# EAGLE schematic pmm (EAGLE 9.6.2)
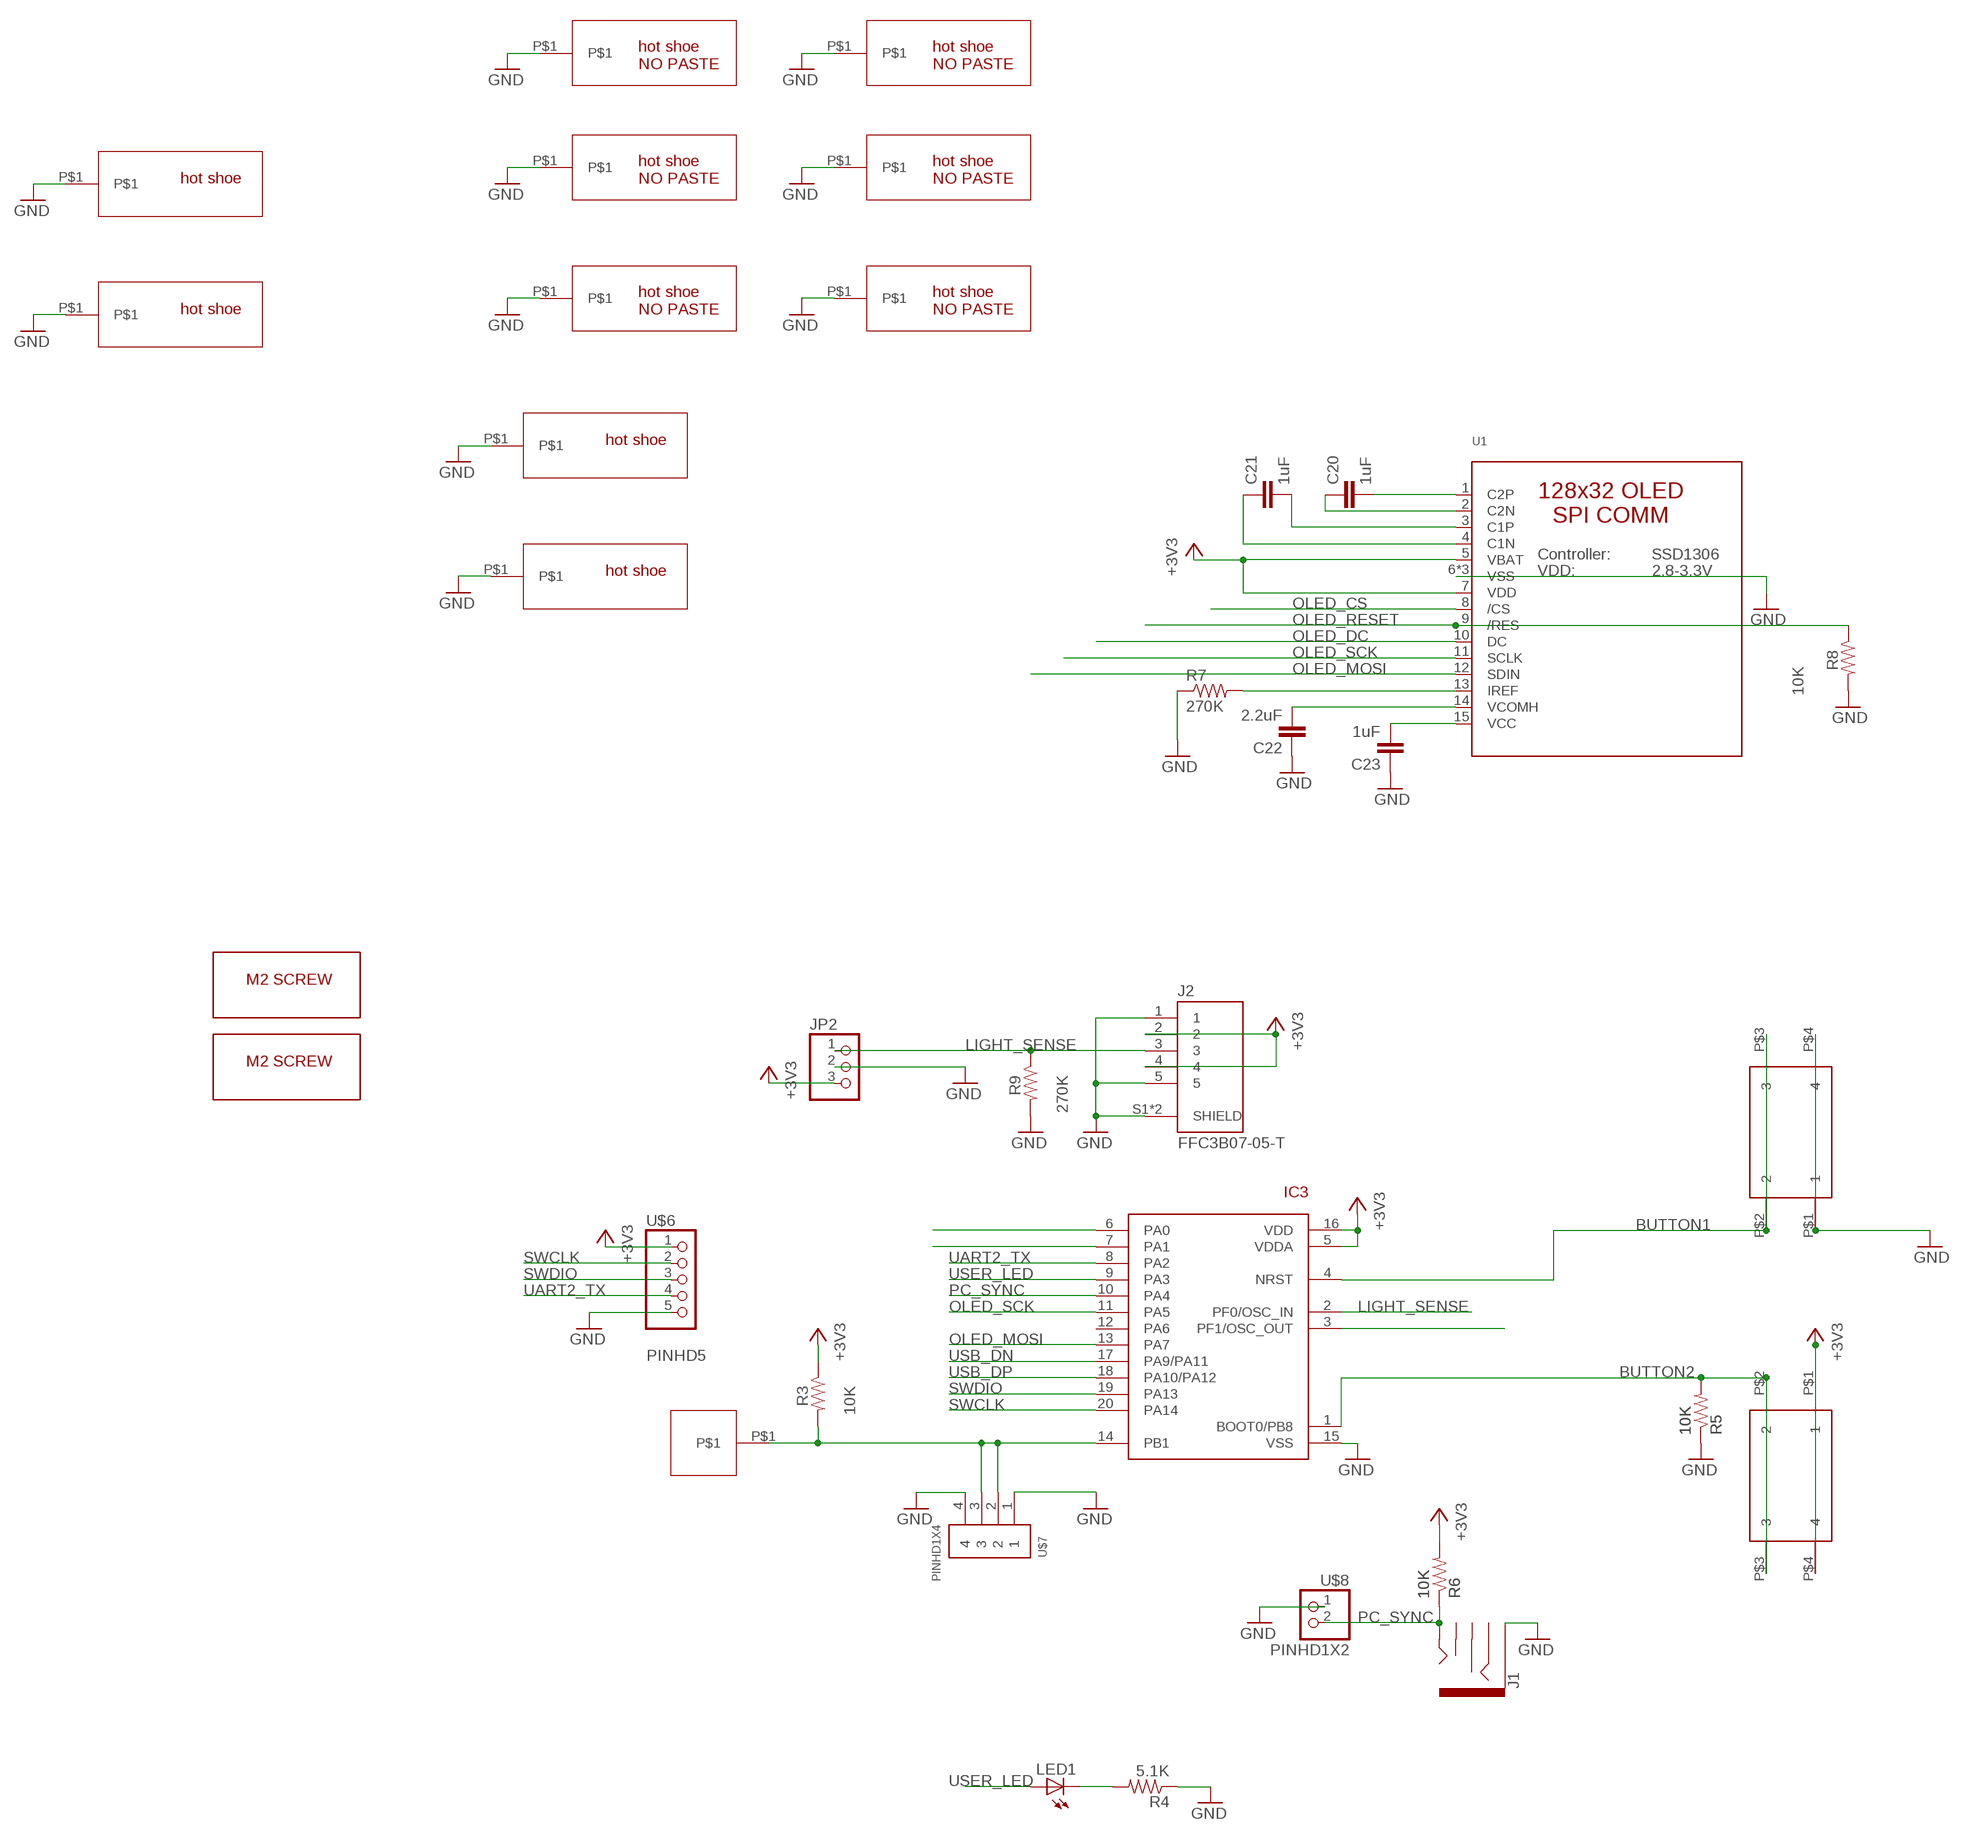
[diagram p0: schematic, sheet 1, part 1 of 2]
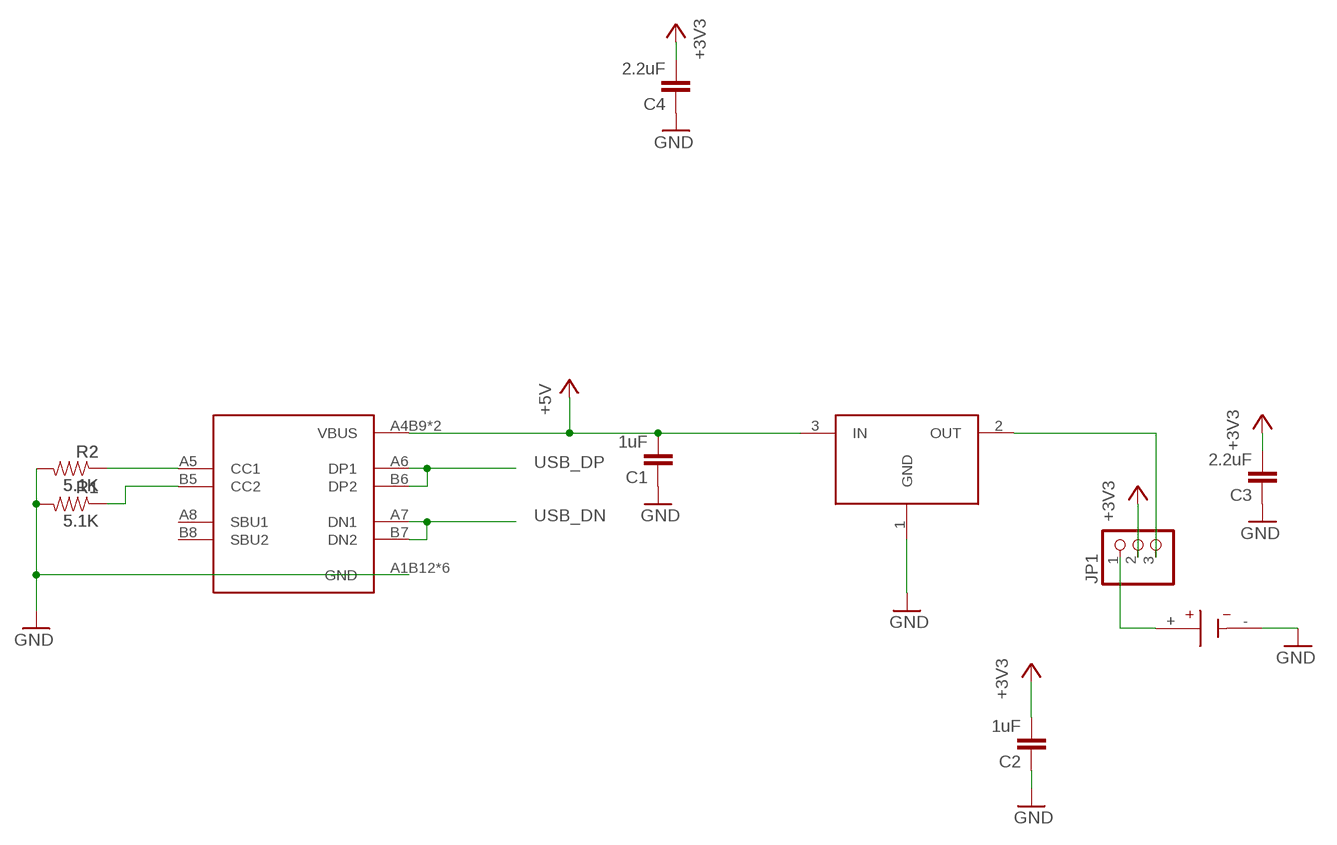
[diagram p1: schematic, sheet 1, part 2 of 2]

## Parts
BT1  BU2032SM-G  [BAT_BU2032SM-G]
C1  1uF  CAP0805  [0805]
C2  1uF  CAP0805  [0805]
C3  2.2uF  CAP0805  [0805]
C4  2.2uF  CAP0805  [0805]
C20  1uF  CAP0805  [0805]
C21  1uF  CAP0805  [0805]
C22  2.2uF  CAP0805  [0805]
C23  1uF  CAP0805  [0805]
IC3  STM32F042F4  [TSSOP20]
J1  AUDIO_JACK_3.5MM_PTH  [AUDIO-JACK]
J2  FFC3B07-05-T  [GCT_FFC3B07-05-T]
JP1  PINHD-1X3CB  [1X03-CLEANBIG]
JP2  PINHD-1X3CB  [1X03-CLEANBIG]
LED1  LEDCHIP-LED0805  [CHIP-LED0805]
R1  5.1K  RESISTOR0805-RES  [0805]
R2  5.1K  RESISTOR0805-RES  [0805]
R3  10K  RESISTOR0805-RES  [0805]
R4  5.1K  RESISTOR0805-RES  [0805]
R5  10K  RESISTOR0805-RES  [0805]
R6  10K  RESISTOR0805-RES  [0805]
R7  270K  RESISTOR0805-RES  [0805]
R8  10K  RESISTOR0805-RES  [0805]
R9  270K  RESISTOR0805-RES  [0805]
SW3  324_SW  [342_SWICH_FOOT]
SW4  324_SW  [342_SWICH_FOOT]
U1  LUL_DISP_OLED_UG-2864HSWEG01  [LUL_UG-2864HSWEG01_1.3_WRAPAROUND]
U2  USBC_16P  [USBC_16P_FOOT]
U4  XC6206_DEV  [SOT23R_INFINEON]
U$1  M2_SCREW_DEV  [M2_SCREW_FOOT]
U$2  SPRING_CONTACT  [SPRING_CONTACT]
U$3  HOTSHOE  [HOTSHOE_RAIL]
U$4  HOTSHOE  [HOTSHOE_RAIL]
U$5  HOTSHOE_NOPASTE  [HOTSHOE_RAIL_NOPASTE]
U$6  PINHD5  [1X05]
U$7  PINHD1X4  [1X04-CLEANBIG]
U$8  PINHD1X2  [1X02]
U$9  HOTSHOE_NOPASTE  [HOTSHOE_RAIL_NOPASTE]
U$10  HOTSHOE_NOPASTE  [HOTSHOE_RAIL_NOPASTE]
U$11  HOTSHOE_NOPASTE  [HOTSHOE_RAIL_NOPASTE]
U$12  M2_SCREW_DEV  [M2_SCREW_FOOT]
U$13  HOTSHOE_NOPASTE  [HOTSHOE_RAIL_NOPASTE]
U$14  HOTSHOE  [HOTSHOE_RAIL]
U$15  HOTSHOE_NOPASTE  [HOTSHOE_RAIL_NOPASTE]
U$16  HOTSHOE  [HOTSHOE_RAIL]

## Nets
+3V3: C2.2 C3.2 C4.2 IC3.5(VDDA) IC3.16(VDD) J2.2 J2.4 JP1.2 JP2.3 R3.1 R6.2 SW4.P$1 SW4.P$4 U1.5(VBAT) U1.7(VDD) U$6.1
+5V: C1.2 U2.A4B9(VBUS) U2.B4A9(VBUS) U4.3(IN)
BUTTON1: IC3.4(NRST) SW3.P$2 SW3.P$3
BUTTON2: IC3.1(BOOT0/PB8) R5.2 SW4.P$2 SW4.P$3
GND: BT1.- C1.1 C2.1 C3.1 C4.1 C22.1 C23.1 IC3.15(VSS) J1.SLEEVE J2.1 J2.5 J2.S1(SHIELD) J2.S2(SHIELD) JP2.2 R1.2 R2.2 R4.1 R5.1 R7.1 R8.2 R9.2 SW3.P$1 SW3.P$4 U1.6(VSS) U1.16(VSS) U1.17(VSS) U2.A1B12(GND) U2.B11A12(GND) U2.P$13(GND) U2.P$14(GND) U2.P$15(GND) U2.P$16(GND) U4.1(GND) U$3.P$1 U$4.P$1 U$5.P$1 U$6.5 U$7.1 U$7.4 U$8.1 U$9.P$1 U$10.P$1 U$11.P$1 U$13.P$1 U$14.P$1 U$15.P$1 U$16.P$1
LIGHT_SENSE: IC3.2(PF0/OSC_IN) J2.3 JP2.1 R9.1
N$2: IC3.14(PB1) R3.2 U$2.P$1 U$7.2 U$7.3
N$3: JP1.3 U4.2(OUT)
N$5: LED1.C R4.2
N$31: R1.1 U2.B5(CC2)
N$33: R2.1 U2.A5(CC1)
N$35: C20.2 U1.1(C2P)
N$36: C20.1 U1.2(C2N)
N$37: C21.2 U1.3(C1P)
N$38: C21.1 U1.4(C1N)
N$39: R7.2 U1.13(IREF)
N$40: C22.2 U1.14(VCOMH)
N$41: C23.2 U1.15(VCC)
OLED_CS: IC3.3(PF1/OSC_OUT) U1.8(/CS)
OLED_DC: IC3.7(PA1) U1.10(DC)
OLED_MOSI: IC3.13(PA7) U1.12(SDIN)
OLED_RESET: IC3.6(PA0) R8.1 U1.9(/RES)
OLED_SCK: IC3.11(PA5) U1.11(SCLK)
PC_SYNC: IC3.10(PA4) J1.TIP R6.1 U$8.2
SWCLK: IC3.20(PA14) U$6.2
SWDIO: IC3.19(PA13) U$6.3
UART2_TX: IC3.8(PA2) U$6.4
USB_DN: IC3.17(PA9/PA11) U2.A7(DN1) U2.B7(DN2)
USB_DP: IC3.18(PA10/PA12) U2.A6(DP1) U2.B6(DP2)
USER_LED: IC3.9(PA3) LED1.A
VBAT: BT1.+ JP1.1
Unconnected: IC3.12(PA6) J1.RING J1.RSH J1.TSH U2.A8(SBU1) U2.B8(SBU2)

## Library data of the parts
BT1 = BU2032SM-G:BU2032SM-G: Batt Holder Smt Coin 20mm Tape Check availability <https://pricing.snapeda.com/parts/BU2032SM-G/MPD/view-part?ref=eda>; AVAILABILITY: In Stock; CHECK_PRICES: https://www.snapeda.com/parts/BU2032SM-G/Memory+Protection+Devices/view-part/?ref=eda; DESCRIPTION: BATTERY HOLDER COIN 20MM SMD; MF: MPD; MP: BU2032SM-G; PACKAGE: None; PRICE: None; PURCHASE-URL: https://www.snapeda.com/api/url_track_click_mouser/?unipart_id=4219599&manufacturer=MPD&part_name=BU2032SM-G&search_term=battery holder; SNAPEDA_LINK: https://www.snapeda.com/parts/BU2032SM-G/Memory+Protection+Devices/view-part/?ref=snap
C1-C4 C20-C23 = clock:CAP: Capacitor Standard 0603 ceramic capacitor, and 0.1" leaded capacitor.
IC3 = tx:STM32F042F4
J1 = SparkFun-Connectors:AUDIO_JACK_3.5MM: Audio Jack 3.5mm variants of PTH and SMT stereo audio jack with bypass switches. SparkFun Products: SparkFun SparkPunk Sound Kit <[https://www.sparkfun.com/products/11177]> - PTH MP3 Trigger <https://www.sparkfun.com/products/13720> -3.5mm SMD SparkFun PicoBoard <https://www.sparkfun.com/products/11888>- 2.5mm SMD; PROD_ID: CONN-08774; SF_ID: PRT-08032
J2 = FFC3B07-05-T:FFC3B07-05-T: FPC 1.0mm Pitch, Side entry, Top contact, SMT, Height 2.5mm, Slide type Check availability <https://pricing.snapeda.com/parts/FFC3B07-05-T/Global%20Connector%20Technology/view-part?ref=eda>; AVAILABILITY: In Stock; CHECK_PRICES: https://www.snapeda.com/parts/FFC3B07-05-T/Global+Connector+Technology/view-part/?ref=eda; DESCRIPTION: 5 Position FFC, FPC Connector Contacts, Bottom 0.039 (1.00mm) Surface Mount, Right Angle; MF: Global Connector Technology; MP: FFC3B07-05-T; PACKAGE: None; PRICE: None; SNAPEDA_LINK: https://www.snapeda.com/parts/FFC3B07-05-T/Global+Connector+Technology/view-part/?ref=snap
JP1 JP2 = adafruit_changed:PINHD-1X3: PIN HEADER
LED1 = adafruit:LED: LED OSRAM: - CHIPLED LG R971, LG N971, LY N971, LG Q971, LY Q971, LO R971, LY R971 LH N974, LH R974 LS Q976, LO Q976, LY Q976 LO Q996 - Hyper CHIPLED LW Q18S LB Q993, LB Q99A, LB R99A - SideLED LS A670, LO A670, LY A670, LG A670, LP A670 LB A673, LV A673, LT A673, LW A673 LH A674 LY A675 LS A676, LA A676, LO A676, LY A676, LW A676 LS A679, LY A679, LG A679 - Hyper Micro SIDELED® LS Y876, LA Y876, LO Y876, LY Y876 LT Y87S - SmartLED LW L88C, LW L88S LB L89C, LB L89S, LG L890 LS L89K, LO L89K, LY L89K LS L896, LA L896, LO L896, LY L896 - TOPLED LS T670, LO T670, LY T670, LG T670, LP T670 LSG T670, LSP T670, LSY T670, LOP T670, LYG T670 LG T671, LOG T671, LSG T671 LB T673, LV T673, LT T673, LW T673 LH T674 LS T676, LA T676, LO T676, LY T676, LB T676, LH T676, LSB T676, LW T676 LB T67C, LV T67C, LT T67C, LS T67K, LO T67K, LY T67K, LW E67C LS E67B, LA E67B, LO E67B, LY E67B, LB E67C, LV E67C, LT E67C LW T67C LS T679, LY T679, LG T679 LS T770, LO T770, LY T770, LG T770, LP T770 LB T773, LV T773, LT T773, LW T773 LH T774 LS E675, LA E675, LY E675, LS T675 LS T776, LA T776, LO T776, LY T776, LB T776 LHGB T686 LT T68C, LB T68C - Hyper Mini TOPLED® LB M676 - Mini TOPLED Santana® LG M470 LS M47K, LO M47K, LY M47K Source: http://www.osram.convergy.de/
R1-R3 R5 R6 R8 R9 = joyAnalog:RESISTOR: Resistor Basic schematic elements and footprints for 0603, 1206, and PTH resistors.
R4 R7 = SparkFun-Passives:RESISTOR: Resistor Basic schematic elements and footprints for 0603, 1206, and PTH resistors.
SW3 SW4 = 3pos_slide_switch_centered:324_SW
U1 = lul:LUL_DISP_OLED_UG-2864HSWEG01: UG-2864HSWEG01 OLED display Both 1.3" and 0.96" models share the same FPC tab footprint, only the screen dimensions vary.
U2 = my_usbc_16p:USBC_16P
U4 = 3pos_slide_switch:XC6206_DEV
U$1 U$12 = 3pos_slide_switch_centered:M2_SCREW_DEV
U$2 = apricot:SPRING_CONTACT
U$3 U$4 U$14 U$16 = apricot:HOTSHOE
U$5 U$9-U$11 U$13 U$15 = apricot:HOTSHOE_NOPASTE
U$6 = adafruit_changed:PINHD5
U$7 = adafruit_changed:PINHD1X4
U$8 = adafruit_changed:PINHD1X2